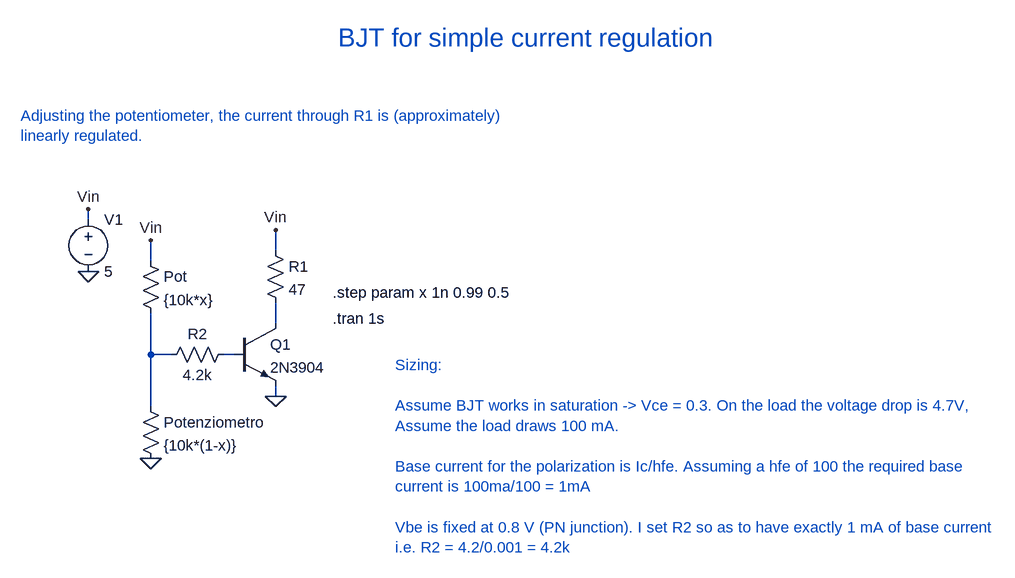
[diagram p0: schematic BJT-for-simple-current-regulation.asc]
BJT-for-simple-current-regulation.asc, the LTspice schematic file:
Version 4.1
SHEET 1 1704 680
WIRE -16 16 -16 0
WIRE 272 64 272 32
WIRE 80 80 80 48
WIRE 272 176 272 144
WIRE 80 224 80 160
WIRE 112 224 80 224
WIRE 208 224 192 224
WIRE 272 288 272 272
WIRE 80 304 80 224
FLAG 80 384 0
FLAG 272 288 0
FLAG -16 0 Vin
FLAG 272 32 Vin
FLAG -16 96 0
FLAG 80 48 Vin
SYMBOL voltage -16 0 R0
WINDOW 123 0 0 Left 2
WINDOW 39 0 0 Left 2
SYMATTR InstName V1
SYMATTR Value 5
SYMBOL res 256 48 R0
SYMATTR InstName R1
SYMATTR Value 47
SYMBOL res 208 208 R90
WINDOW 0 0 56 VBottom 2
WINDOW 3 32 56 VTop 2
SYMATTR InstName R2
SYMATTR Value 4.2k
SYMBOL res 64 288 R0
SYMATTR InstName Potenziometro
SYMATTR Value {10k*(1-x)}
SYMBOL npn 208 176 R0
SYMATTR InstName Q1
SYMATTR Value 2N3904
SYMBOL res 64 64 R0
SYMATTR InstName Pot
SYMATTR Value {10k*x}
TEXT 360 128 Left 2 !.step param x 1n 0.99 0.5
TEXT 360 168 Left 2 !.tran 1s
TEXT -120 -144 Left 2 ;Adjusting the potentiometer, the current through R1 is (approximately)\nlinearly regulated.
TEXT 456 240 Left 2 ;Sizing: \n \nAssume BJT works in saturation -> Vce = 0.3. On the load the voltage drop is 4.7V,\nAssume the load draws 100 mA.\n \nBase current for the polarization is Ic/hfe. Assuming a hfe of 100 the required base\ncurrent is 100ma/100 = 1mA\n \nVbe is fixed at 0.8 V (PN junction). I set R2 so as to have exactly 1 mA of base current\ni.e. R2 = 4.2/0.001 = 4.2k
TEXT 368 -264 Left 4 ;BJT for simple current regulation

The netlist it stands for:
* BJT-for-simple-current-regulation.asc
V1 Vin 0 5
R1 Vin N001 47
R2 N003 N002 4.2k
R§Potenziometro N002 0 {10k*(1-x)}
Q1 N001 N003 0 0 2N3904
R§Pot Vin N002 {10k*x}
.model NPN NPN
.model PNP PNP
.lib standard.bjt
.step param x 1n 0.99 0.5
.tran 1s
* Adjusting the potentiometer, the current through R1 is (approximately)
* linearly regulated.
* Sizing:
* Assume BJT works in saturation -> Vce = 0.3. On the load the voltage drop is 4.7V,
* Assume the load draws 100 mA.
* Base current for the polarization is Ic/hfe. Assuming a hfe of 100 the required base
* current is 100ma/100 = 1mA
* Vbe is fixed at 0.8 V (PN junction). I set R2 so as to have exactly 1 mA of base current
* i.e. R2 = 4.2/0.001 = 4.2k
* BJT for simple current regulation
.backanno
.end